# Altium schematic sheet Too Head PCB REV0.3.SchDoc
size A
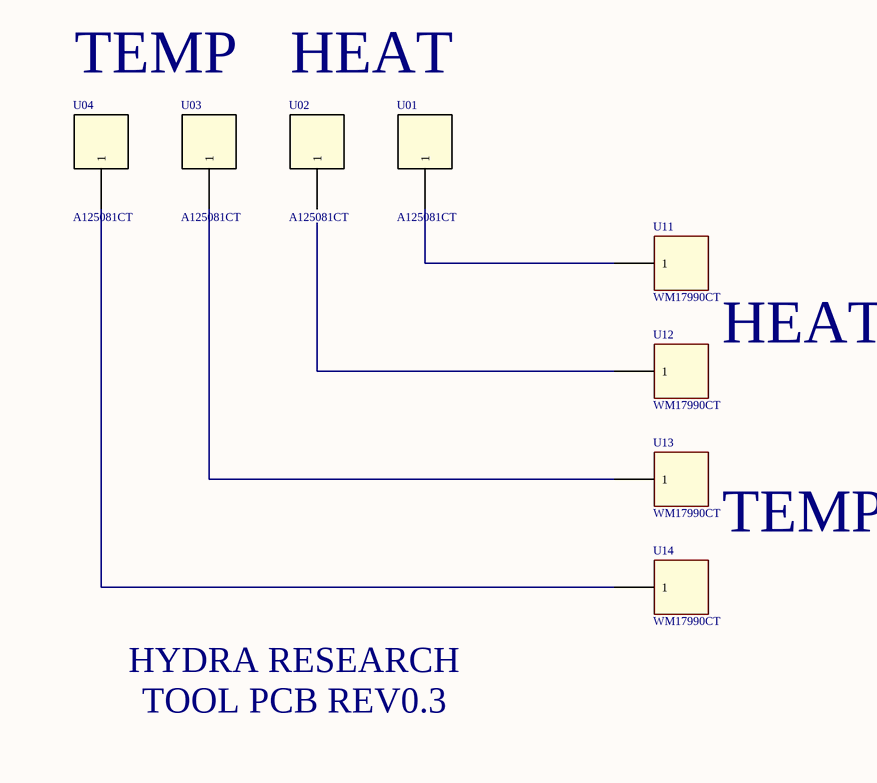
[diagram p0: Too Head PCB REV0.3.SchDoc]

## Parts
U01  A125081CT  [A125081CT-ND]
U02  A125081CT  [A125081CT-ND]
U03  A125081CT  [A125081CT-ND]
U04  A125081CT  [A125081CT-ND]
U11  WM17990CT  [WM17990CT-ND-l]
U12  WM17990CT  [WM17990CT-ND-l]
U13  WM17990CT  [WM17990CT-ND-l]
U14  WM17990CT  [WM17990CT-ND-l]

## Nets
NetU01_?: U01.?(1) U11.?(1)
NetU03_?: U03.?(1) U13.?(1)
NetU04_?: U04.?(1) U14.?(1)

Not connected (* = marked no-connect by the designer): U02 ?(1); U12 ?(1)

## Notes on the sheet
- TEMP
- HEAT
- HYDRA RESEARCH
- TOOL PCB REV0.3

## Library data of the parts
U11-U14 = WM17990CT: MPN: WM17990CT-ND
U01 U02 U03 U04 = A125081CT: MPN: A125081CT-ND